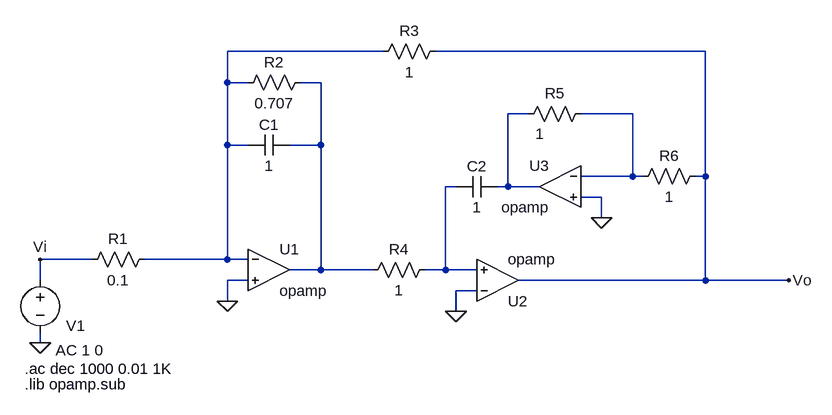
[diagram p0: schematic TS2.asc]
TS2.asc, the LTspice schematic file:
Version 4
SHEET 1 1104 680
WIRE 416 -16 176 -16
WIRE 912 -16 496 -16
WIRE 176 32 176 -16
WIRE 208 32 176 32
WIRE 320 32 288 32
WIRE 640 80 608 80
WIRE 800 80 720 80
WIRE 176 128 176 32
WIRE 208 128 176 128
WIRE 320 128 320 32
WIRE 320 128 272 128
WIRE 800 176 800 80
WIRE 800 176 720 176
WIRE 816 176 800 176
WIRE 912 176 912 -16
WIRE 912 176 896 176
WIRE 528 192 512 192
WIRE 608 192 608 80
WIRE 608 192 592 192
WIRE 656 192 608 192
WIRE 752 208 720 208
WIRE 752 240 752 208
WIRE -32 304 -112 304
WIRE 176 304 176 128
WIRE 176 304 48 304
WIRE 208 304 176 304
WIRE 320 320 320 128
WIRE 320 320 272 320
WIRE 400 320 320 320
WIRE 512 320 512 192
WIRE 512 320 480 320
WIRE 560 320 512 320
WIRE -112 336 -112 304
WIRE 208 336 176 336
WIRE 912 336 912 176
WIRE 912 336 624 336
WIRE 1040 336 912 336
WIRE 560 352 528 352
WIRE 176 368 176 336
WIRE 528 384 528 352
WIRE -112 432 -112 416
FLAG 176 368 0
FLAG 528 384 0
FLAG 752 240 0
FLAG -112 304 Vi
FLAG -112 432 0
FLAG 1040 336 Vo
SYMBOL res 64 288 R90
WINDOW 0 0 56 VBottom 2
WINDOW 3 32 56 VTop 2
SYMATTR InstName R1
SYMATTR Value 0.1
SYMBOL res 304 16 R90
WINDOW 0 0 56 VBottom 2
WINDOW 3 32 56 VTop 2
SYMATTR InstName R2
SYMATTR Value 0.707
SYMBOL res 512 -32 R90
WINDOW 0 0 56 VBottom 2
WINDOW 3 32 56 VTop 2
SYMATTR InstName R3
SYMATTR Value 1
SYMBOL res 496 304 R90
WINDOW 0 0 56 VBottom 2
WINDOW 3 32 56 VTop 2
SYMATTR InstName R4
SYMATTR Value 1
SYMBOL res 736 64 R90
WINDOW 0 0 56 VBottom 2
WINDOW 3 31 79 VTop 2
SYMATTR InstName R5
SYMATTR Value 1
SYMBOL res 912 160 R90
WINDOW 0 0 56 VBottom 2
WINDOW 3 32 56 VTop 2
SYMATTR InstName R6
SYMATTR Value 1
SYMBOL cap 272 112 R90
WINDOW 0 0 32 VBottom 2
WINDOW 3 32 32 VTop 2
SYMATTR InstName C1
SYMATTR Value 1
SYMBOL cap 592 176 R90
WINDOW 0 0 32 VBottom 2
WINDOW 3 32 32 VTop 2
SYMATTR InstName C2
SYMATTR Value 1
SYMBOL voltage -112 320 R0
WINDOW 0 40 86 Left 2
WINDOW 123 24 124 Left 2
WINDOW 39 0 0 Left 0
SYMATTR InstName V1
SYMATTR Value2 AC 1 0
SYMATTR Value ""
SYMBOL OpAmps\\opamp 240 256 R0
SYMATTR InstName U1
SYMBOL OpAmps\\opamp 592 400 M180
SYMATTR InstName U2
SYMBOL OpAmps\\opamp 688 128 M0
SYMATTR InstName U3
TEXT -136 472 Left 2 !.ac dec 1000 0.01 1K
TEXT -136 496 Left 2 !.lib opamp.sub

The netlist it stands for:
* TS2.asc
R1 N001 Vi 0.1
R2 N002 N001 0.707
R3 Vo N001 1
R4 N005 N002 1
R5 N004 N003 1
R6 Vo N004 1
C1 N002 N001 1
C2 N003 N005 1
V1 Vi 0 AC 1 0
XU1 N001 0 N002 opamp Aol=100K GBW=10Meg  ; pins invin noninvin out
XU2 0 N005 Vo opamp Aol=100K GBW=10Meg  ; pins invin noninvin out
XU3 N004 0 N003 opamp Aol=100K GBW=10Meg  ; pins invin noninvin out
.ac dec 1000 0.01 1K
.lib opamp.sub
.backanno
.end